# EAGLE design SCH1 (EAGLE 7.6.0)
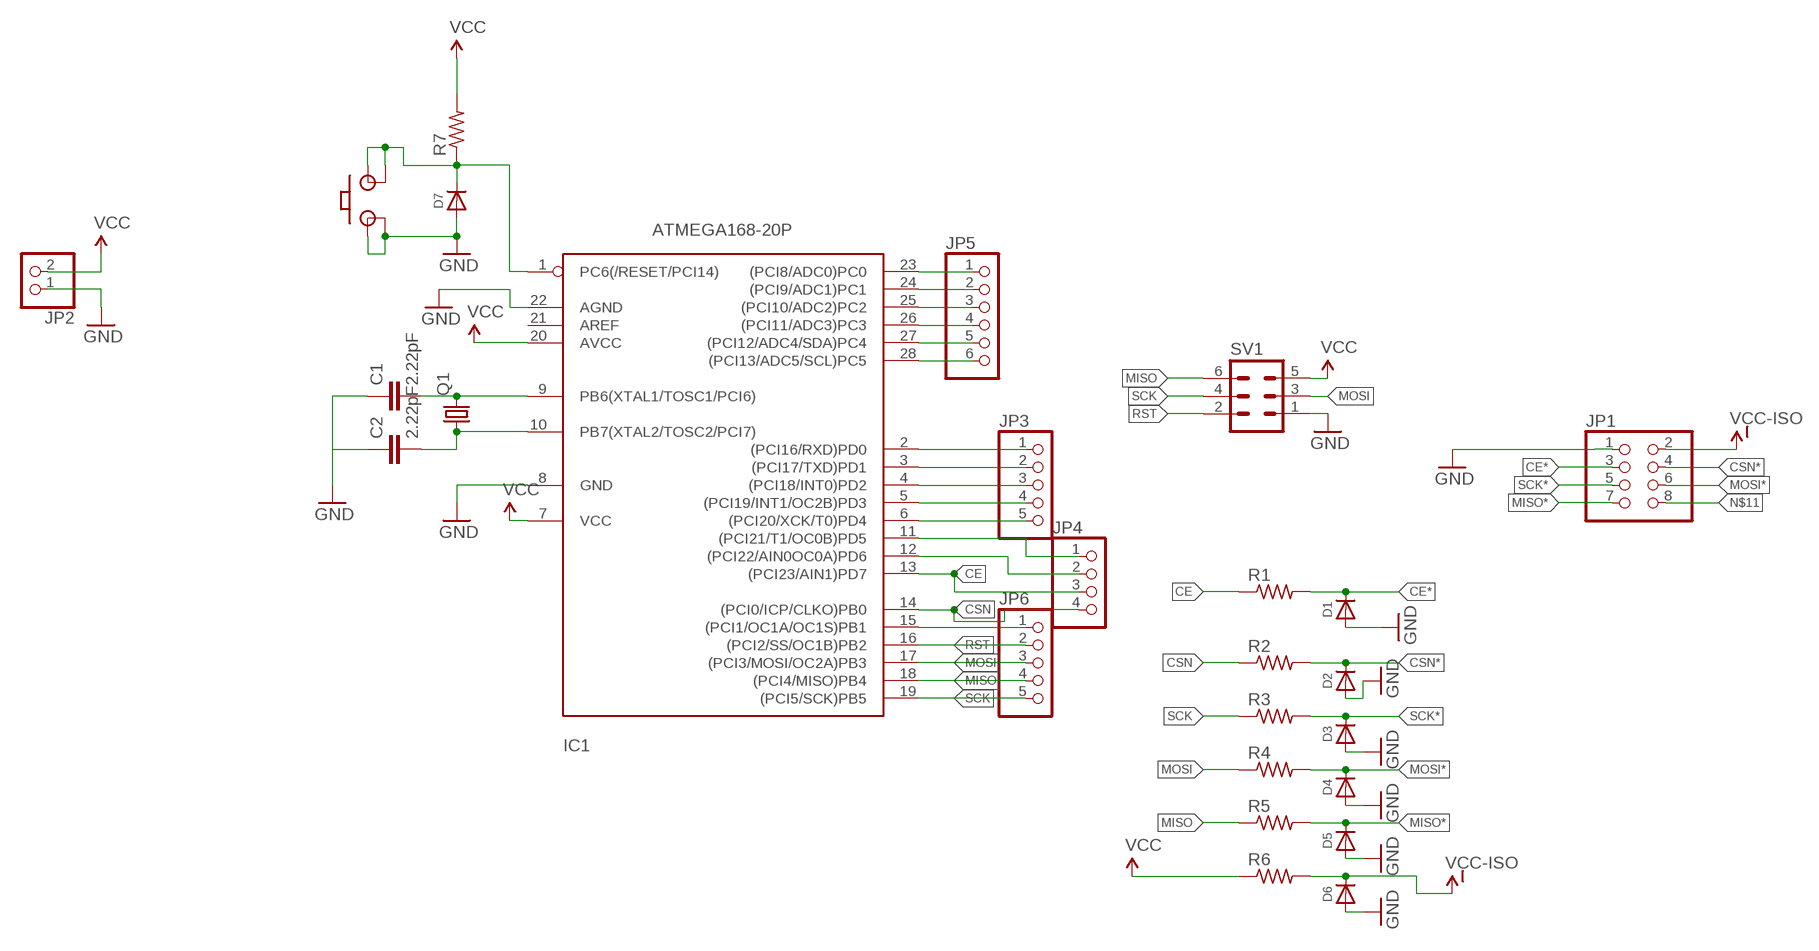
[diagram p0: schematic, sheet 1]

## Parts
C1  2.22pF  C-EU025-024X044  [C025-024X044]
C2  2.22pF  C-EU025-024X044  [C025-024X044]
D1  DIODEDO-1N4148  [DO-1N4148]
D2  DIODEDO-1N4148  [DO-1N4148]
D3  DIODEDO-1N4148  [DO-1N4148]
D4  DIODEDO-1N4148  [DO-1N4148]
D5  DIODEDO-1N4148  [DO-1N4148]
D6  DIODEDO-1N4148  [DO-1N4148]
D7  DIODEDO-1N4148  [DO-1N4148]
IC1  ATMEGA168-20P  [DIL28-3]
JP1  PINHD-2X4  [2X04]
JP2  PINHD-1X2  [1X02]
JP3  PINHD-1X5  [1X05]
JP4  PINHD-1X4  [1X04]
JP5  PINHD-1X6  [1X06]
JP6  PINHD-1X5  [1X05]
PB1  TACTSW  [TACTSW]
Q1  CRYSTALHC49U-V  [HC49U-V]
R1  R-US_0207/7  [0207/7]
R2  R-US_0207/7  [0207/7]
R3  R-US_0207/7  [0207/7]
R4  R-US_0207/7  [0207/7]
R5  R-US_0207/7  [0207/7]
R6  R-US_0207/7  [0207/7]
R7  R-US_0207/7  [0207/7]
SV1  MA03-2  [MA03-2]

## Nets
CE: IC1.13((PCI23/AIN1)PD7) JP4.3 R1.1
CE*: D1.C JP1.3 R1.2
CSN: IC1.14((PCI0/ICP/CLKO)PB0) JP4.4 R2.1
CSN*: D2.C JP1.4 R2.2
GND: C1.1 C2.1 D1.A D2.A D3.A D4.A D5.A D6.A D7.A IC1.8(GND) IC1.22(AGND) JP1.1 JP2.1 PB1.P$1 PB1.P$2 SV1.1
MISO: IC1.18((PCI4/MISO)PB4) JP6.4 R5.1 SV1.6
MISO*: D5.C JP1.7 R5.2
MOSI: IC1.17((PCI3/MOSI/OC2A)PB3) JP6.3 R4.1 SV1.3
MOSI*: D4.C JP1.6 R4.2
N$1: C1.2 IC1.9(PB6(XTAL1/TOSC1/PCI6)) Q1.2
N$2: C2.2 IC1.10(PB7(XTAL2/TOSC2/PCI7)) Q1.1
N$4: D7.C IC1.1(PC6(/RESET/PCI14)) PB1.P$3 PB1.P$4 R7.1
N$5: IC1.2((PCI16/RXD)PD0) JP3.1
N$6: IC1.3((PCI17/TXD)PD1) JP3.2
N$7: IC1.4((PCI18/INT0)PD2) JP3.3
N$8: IC1.5((PCI19/INT1/OC2B)PD3) JP3.4
N$9: IC1.6((PCI20/XCK/T0)PD4) JP3.5
N$10: IC1.11((PCI21/T1/OC0B)PD5) JP4.1
N$11: JP1.8
N$12: IC1.12((PCI22/AIN0OC0A)PD6) JP4.2
N$13: IC1.23((PCI8/ADC0)PC0) JP5.1
N$15: IC1.24((PCI9/ADC1)PC1) JP5.2
N$16: IC1.25((PCI10/ADC2)PC2) JP5.3
N$17: IC1.26((PCI11/ADC3)PC3) JP5.4
N$18: IC1.27((PCI12/ADC4/SDA)PC4) JP5.5
N$19: IC1.28((PCI13/ADC5/SCL)PC5) JP5.6
N$20: IC1.15((PCI1/OC1A/OC1S)PB1) JP6.1
RST: IC1.16((PCI2/SS/OC1B)PB2) JP6.2 SV1.2
SCK: IC1.19((PCI5/SCK)PB5) JP6.5 R3.1 SV1.4
SCK*: D3.C JP1.5 R3.2
VCC: IC1.7(VCC) IC1.20(AVCC) JP2.2 R6.1 R7.2 SV1.5
VCC-ISO: D6.C JP1.2 R6.2
Unconnected: IC1.21(AREF)

## Library data of the parts
C1 C2 = CustomLib:C-EU: CAPACITOR, European symbol
D1-D7 = CustomLib:DIODE: Diode SMA Model Volts Amps Type Vf Ir Digikey # Notes SSA34-E3 40V 3A Schottky 480mV @ 3A 200uA @ 40V SSA34-E3/61TGITR-ND CDBA120-G 20V 1A Schottky 500mV @ 1A 500uA @ 20V 641-1014-6-ND REEL MBRA210 10V 2A Schottky 350mV @ 2A 700uA @ 10V MBRA210LT3 SOD-123 Model Volts Amps Type Vf Ir Order # Notes BAT54T1G 30V 200mA Schottky 800mV @ 200mA 2uA @ 25V BAT54T1GOSTR-ND B0530W 30V 500mA Schottky 430mV @ 500mA 130uA @ 30V B0530W-FDICT-ND REEL MBR120 20V 1A Schottky 340mV @ 1A MBR120VLSFT1GOSCT-ND SOD-323 Model Volts Amps Type Vf Ir Order # Notes PMEG2005EJ 20V 500mA Schottky 355mV @ 500mA 568-4110-1-ND ZLLS410 10V 570mA Schottky 380mV @ 570mA ZLLS410CT-ND 1N4148WS 75V 150mA Silicon/Simple 1V 1N4148WSFSCT-ND REEL SOD-523 Model Volts Amps Type Vf Ir Order # Notes BAT54XV2 30V 200mA Schottky 0.8V @ 100mA BAT54XV2CT-ND TB751S 30V 30mA Schottky RB751S-40TE61CT-ND SOT23-R/W (R = Solder Paste/Reflow Ovens, W = Hand-Soldering) Model Volts Amps Type Vf Ir Order # Notes BAT54FILM 40V 300mA Schottky 497-7162-1-ND POWERDI-5 Model Volts Amps Type Vf Ir Order # Notes PDS560 60V 5A Schottky 670mV @ 5A 150uA @ 60V PDS560DICT-ND
IC1 = adafruit:ATMEGA168*P: MICROCONTROLLER 16 kBytes FLASH 1 kBytes SRAM 512 Bytes EEPROM USART 8-channel 10 bit ADC
JP1 = adafruit:PINHD-2X4: PIN HEADER
JP2 = pinhead:PINHD-1X2: PIN HEADER
JP3 JP6 = pinhead:PINHD-1X5: PIN HEADER
JP4 = pinhead:PINHD-1X4: PIN HEADER
JP5 = pinhead:PINHD-1X6: PIN HEADER
PB1 = TACTSW:TACTSW
Q1 = adafruit:CRYSTAL: CRYSTAL; OC_FARNELL: 1666969; OC_NEWARK: unknown
R1-R7 = resistor:R-US_: RESISTOR, American symbol
SV1 = con-lstb:MA03-2: PIN HEADER; OC_FARNELL: unknown; OC_NEWARK: unknown

## Board
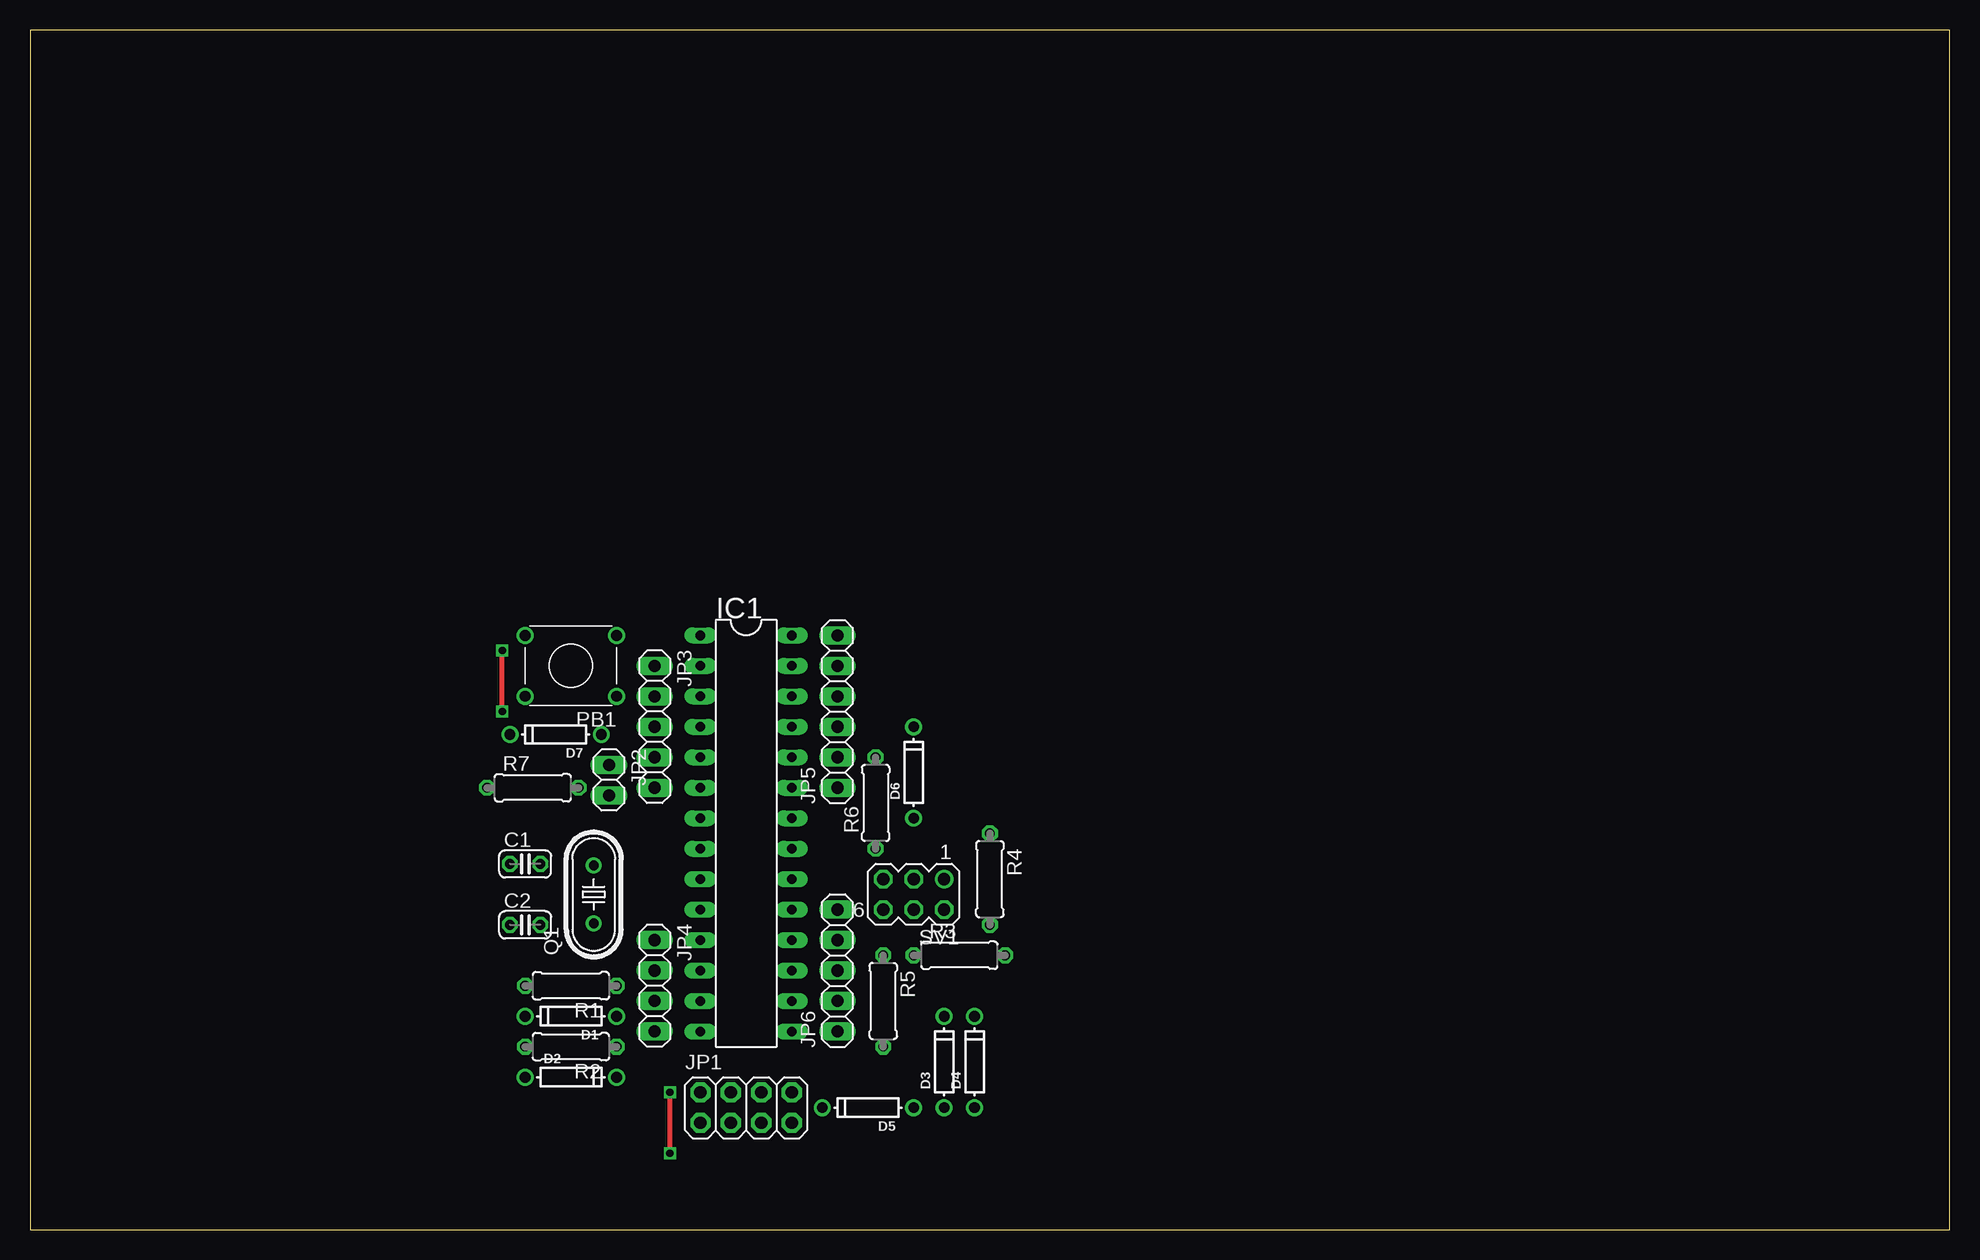
[diagram p1: board, top side]
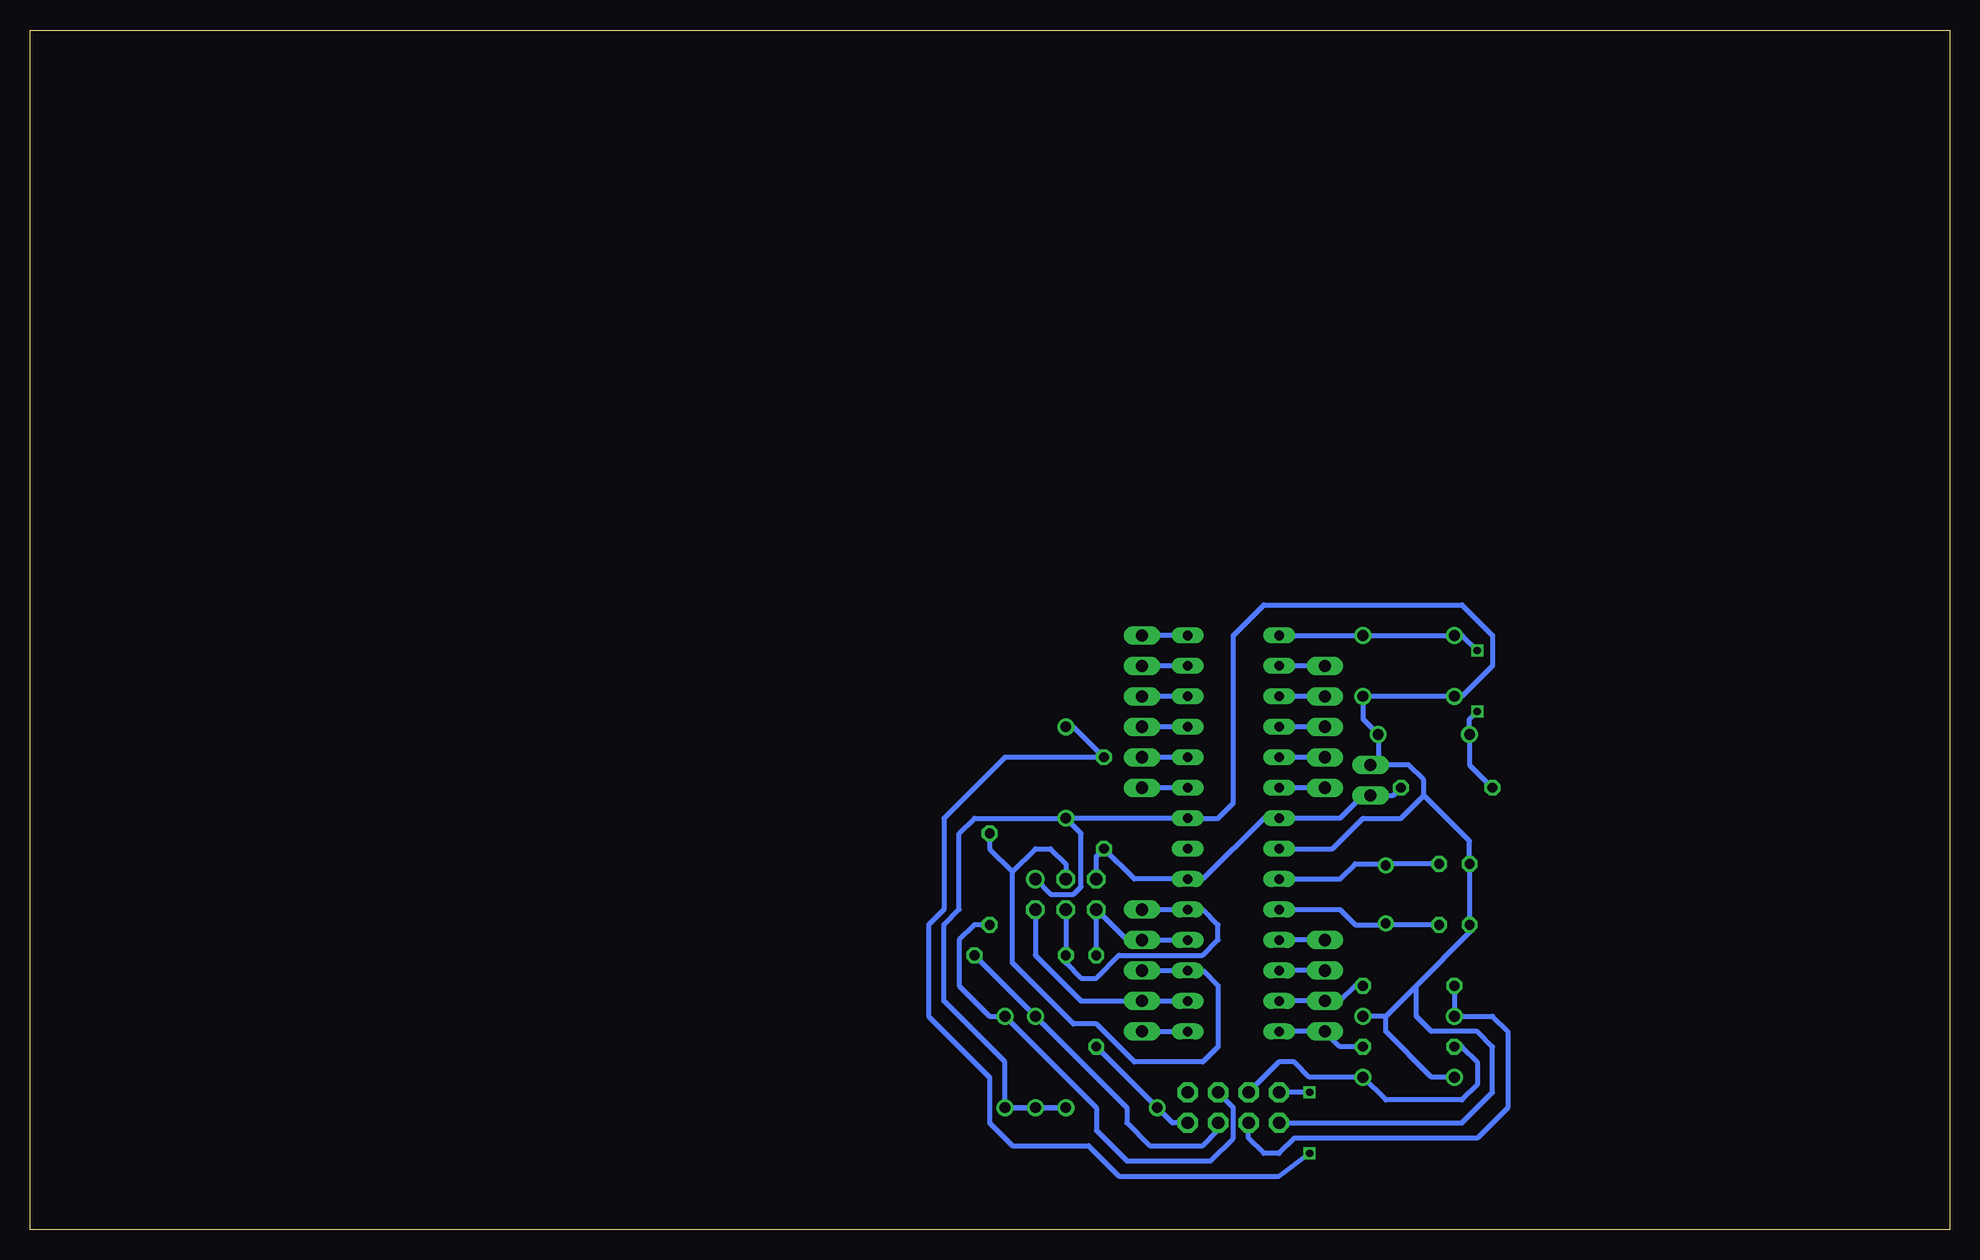
[diagram p2: board, bottom side, seen from below]

Size 160 x 100 mm. Coordinates in mm from the lower left corner, seen from the top.
Outline: 0,0 160,0 160,100 0,100 0,0
Copper layers (1*16): Top 0.035mm / dielectric 1.5mm / Bottom 0.035mm
Design rules "default": minimum track width 10mil, minimum drill 24mil, track to track 8mil, track to pad 8mil, pad to pad 8mil, via to via 8mil, smd to smd 8mil, copper to edge 40mil, drill to drill 8mil, minimum pad ring 10mil, minimum via ring 8mil, stop-mask expansion 4mil, vias tented up to drill 0mil, thermal gap 10mil

### Footprints (pad centres in the part's own frame; a part is rotated, then mirrored left to right if it is on the bottom)
C025-024X044 = drill 0.813 octagon: 1 -1.27,0; 2 1.27,0
DO-1N4148 = drill 0.9: A -3.81,0; C 3.81,0
DIL28-3 = drill 0.813 long: 1 -16.51,-3.81; 2 -13.97,-3.81; 3 -11.43,-3.81; 4 -8.89,-3.81; 5 -6.35,-3.81; 6 -3.81,-3.81; 7 -1.27,-3.81; 8 1.27,-3.81; 9 3.81,-3.81; 10 6.35,-3.81; 11 8.89,-3.81; 12 11.43,-3.81; 13 13.97,-3.81; 14 16.51,-3.81; 15 16.51,3.81; 16 13.97,3.81; 17 11.43,3.81; 18 8.89,3.81; 19 6.35,3.81; 20 3.81,3.81; 21 1.27,3.81; 22 -1.27,3.81; 23 -3.81,3.81; 24 -6.35,3.81; 25 -8.89,3.81; 26 -11.43,3.81; 27 -13.97,3.81; 28 -16.51,3.81
2X04 = drill 1.016 pad 1.676 octagon: 1 -3.81,-1.27; 2 -3.81,1.27; 3 -1.27,-1.27; 4 -1.27,1.27; 5 1.27,-1.27; 6 1.27,1.27; 7 3.81,-1.27; 8 3.81,1.27
1X02 = drill 1.016 long: 1 -1.27,0; 2 1.27,0
1X05 = drill 1.016 long: 1 -5.08,0; 2 -2.54,0; 3 0,0; 4 2.54,0; 5 5.08,0
1X04 = drill 1.016 long: 1 -3.81,0; 2 -1.27,0; 3 1.27,0; 4 3.81,0
1X06 = drill 1.016 long: 1 -6.35,0; 2 -3.81,0; 3 -1.27,0; 4 1.27,0; 5 3.81,0; 6 6.35,0
TACTSW = drill 0.9: P$1 -3.81,2.54; P$2 3.81,2.54; P$3 -3.81,-2.54; P$4 3.81,-2.54
HC49U-V = drill 0.813: 1 -2.413,0; 2 2.413,0
0207/7 = drill 0.813 octagon: 1 -3.81,0; 2 3.81,0
MA03-2 = drill 1.016: 1 -2.54,-1.27 | drill 1.016 octagon: 2 -2.54,1.27; 3 0,-1.27; 4 0,1.27; 5 2.54,-1.27; 6 2.54,1.27

### Placement (x,y rotation side)
C1  41.27,30.48 0 top
C2  41.27,25.4 0 top
D1  45.09,17.78 180 top
D2  45.09,12.7 0 top
D3  76.2,13.97 90 top
D4  78.74,13.97 90 top
D5  69.85,10.16 180 top
D6  73.66,38.1 90 top
D7  43.81,41.27 180 top
IC1  59.69,33.02 270 top
JP1  59.69,10.16 0 top
JP2  48.26,37.47 270 top
JP3  52.07,41.91 270 top
JP4  52.07,20.32 270 top
JP5  67.31,43.18 90 top
JP6  67.31,21.59 90 top
PB1  45.09,46.99 180 top
Q1  46.99,27.94 90 top
R1  45.09,20.32 180 top
R2  45.09,15.24 180 top
R3  77.47,22.86 0 top
R4  80.01,29.21 270 top
R5  71.12,19.05 270 top
R6  70.48,35.56 90 top
R7  41.91,36.83 0 top
SV1  73.66,27.94 180 top

### Tracks (layer width: path | path; a pad name or v marks a point on that pad's centre or on a via)
CE
  Bottom 0.406: IC1.13 JP4.3 50.8,19.05 49.53,20.32 R1.1
CE*
  Bottom 0.406: R1.2 D1.C | D1.C 40.64,17.78 | JP1.3 58.42,7.62 57.15,6.35 55.88,6.35 54.61,7.62 39.37,7.62 36.83,10.16 36.83,16.51 38.1,17.78 D1.C
CSN
  Bottom 0.406: IC1.14 JP4.4 50.8,15.24 R2.1
CSN*
  Bottom 0.406: R2.2 40.64,15.24 39.37,13.97 39.37,12.06 40.64,10.79 46.99,10.79 D2.C 53.34,12.7 54.61,13.97 55.88,13.97 JP1.4
GND
  Bottom 0.406: SV1.1 74.93,27.94 73.03,27.94 72.39,28.57 72.39,33.02 D6.A | D6.A IC1.22 60.96,34.29 59.69,35.56 59.69,49.53 57.15,52.07 40.64,52.07 38.1,49.53 38.1,46.99 40.64,44.45 PB1.P$2 PB1.P$1 48.9,42.55 D7.A 47.62,39.37 JP2.1 45.09,38.73 43.81,37.47 43.81,36.2 | D4.A D3.A D5.A D4.A | D4.A 78.74,13.97 83.82,19.05 83.82,25.4 82.55,26.67 82.55,33.02 81.28,34.29 D6.A | IC1.8 51.44,31.75 48.9,34.29 45.72,34.29 43.81,36.2 | 43.81,36.2 40.01,32.38 C1.1 C2.1 40.01,24.77 44.45,20.32 | 44.45,20.32 46.99,17.78 | 46.99,17.78 D1.A | D2.A 43.18,12.7 46.99,16.51 46.99,17.78 | JP1.1 40.64,8.89 38.1,11.43 38.1,15.24 39.37,16.51 43.18,16.51 44.45,17.78 44.45,20.32
MISO
  Bottom 0.406: IC1.18 JP6.4 68.58,24.13 SV1.6 R5.1
MISO*
  Bottom 0.406: JP1.7 64.77,8.89 D5.C R5.2
MOSI
  Bottom 0.406: JP6.3 IC1.17 62.23,21.59 60.96,20.32 60.96,15.24 62.23,13.97 67.94,13.97 71.12,17.14 73.03,17.14 78.11,22.23 78.11,29.84 | 78.11,29.84 76.2,31.75 74.93,31.75 73.66,30.48 SV1.3 | R4.1 80.01,31.75 78.11,29.84
MOSI*
  Bottom 0.406: R4.2 81.28,25.4 82.55,24.13 82.55,20.32 80.01,17.78 D4.C 71.12,10.16 71.12,8.26 68.58,5.71 61.59,5.71 59.69,7.62 59.69,10.16 JP1.6
N$1
  Bottom 0.406: IC1.9 50.8,29.21 49.53,30.48 47.12,30.48 Q1.2 46.86,30.48 C1.2
N$2
  Bottom 0.406: IC1.10 50.8,26.67 49.53,25.4 47.12,25.4 Q1.1 46.86,25.4 C2.2
N$4  (via drill 0.6)
  Top 0.406: v39.37,43.18 v39.37,48.26
  Bottom 0.406: IC1.1 PB1.P$3 PB1.P$4 40.64,49.53 v39.37,48.26 | v39.37,43.18 40.01,42.55 D7.C 40.01,38.73 R7.1
N$5
  Bottom 0.406: JP3.1 IC1.2
N$6
  Bottom 0.406: JP3.2 IC1.3
N$7
  Bottom 0.406: JP3.3 IC1.4
N$8
  Bottom 0.406: JP3.4 IC1.5
N$9
  Bottom 0.406: JP3.5 IC1.6
N$10
  Bottom 0.406: JP4.1 IC1.11
N$12
  Bottom 0.406: JP4.2 IC1.12
N$13
  Bottom 0.406: IC1.23 JP5.1
N$14  (via drill 0.6)
  other vias: 53.34,11.43
N$15
  Bottom 0.406: IC1.24 JP5.2
N$16
  Bottom 0.406: IC1.25 JP5.3
N$17
  Bottom 0.406: IC1.26 JP5.4
N$18
  Bottom 0.406: IC1.27 JP5.5
N$19
  Bottom 0.406: IC1.28 JP5.6
N$20
  Bottom 0.406: JP6.1 IC1.15
N$21  (via drill 0.6)
  other vias: 39.37,43.18
RST
  Bottom 0.406: IC1.16 JP6.2 72.39,19.05 76.2,22.86 SV1.2
SCK
  Bottom 0.406: JP6.5 IC1.19 62.23,26.67 60.96,25.4 60.96,24.13 62.23,22.86 69.22,22.86 71.12,20.95 72.39,20.95 73.66,22.23 R3.1 SV1.4
SCK*
  Bottom 0.406: R3.2 D3.C 68.58,10.16 68.58,8.89 66.67,6.99 62.23,6.99 60.96,8.26 JP1.5
VCC
  Bottom 0.406: SV1.5 71.12,31.11 R6.1 67.94,29.21 IC1.20 62.23,29.21 57.15,34.29 IC1.7 50.8,34.29 48.9,36.2 JP2.2 46.35,36.2 R7.2
VCC-ISO  (via drill 0.6)
  Top 0.406: v53.34,6.35 v53.34,11.43
  Bottom 0.406: D6.C 73.03,41.91 R6.2 78.74,39.37 83.82,34.29 83.82,26.67 85.09,25.4 85.09,17.78 80.01,12.7 80.01,8.89 78.11,6.99 71.75,6.99 69.22,4.45 55.88,4.45 v53.34,6.35 | v53.34,11.43 JP1.2